# Altium schematic sheet 001-0001_Christmas_Ornament.SchDoc: Christmas Ornament
size A3; ApprovedBy: [FILL-HERE]; Author: HILT; Organization: Hilt; Address1: [FILL-HERE]; Address2: [FILL-HERE]; Address3: [FILL-HERE]; Address4: [FILL-HERE]; DocumentNumber: 001-0001; Revision: 0; SheetNumber: 1; SheetTotal: 2; ProjectTitle: Christmas Ornament
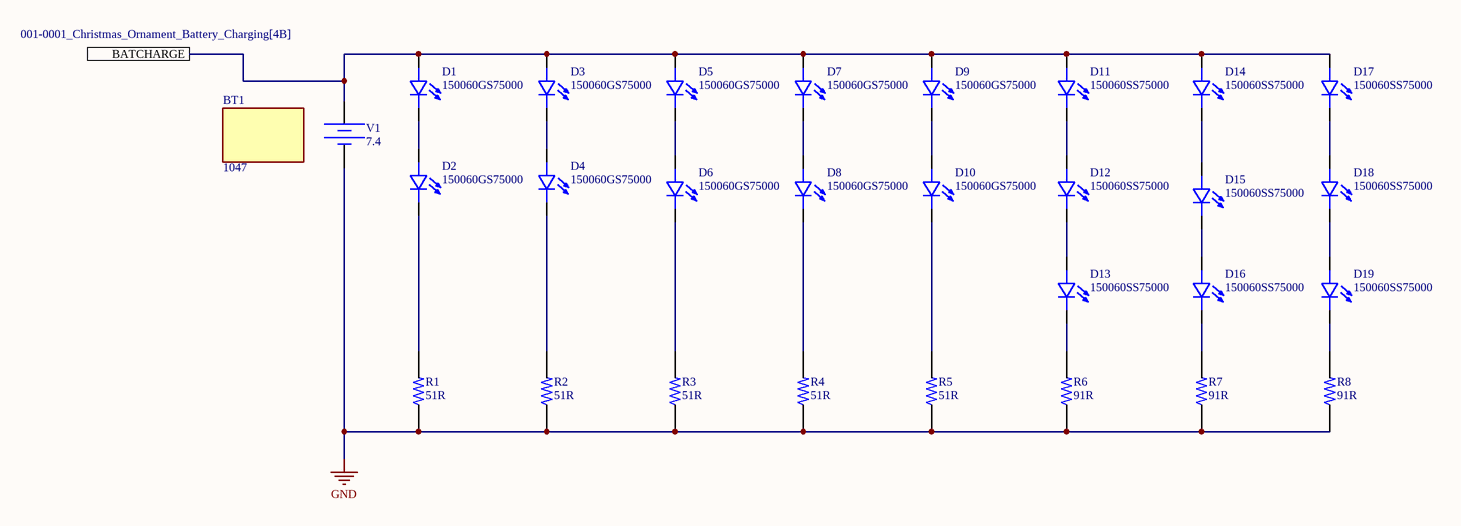
[diagram p0: 001-0001_Christmas_Ornament.SchDoc]

## Parts
BT1  1047  [BAT_1047]
D1  150060GS75000  [LEDC1608X80N]
D2  150060GS75000  [LEDC1608X80N]
D3  150060GS75000  [LEDC1608X80N]
D4  150060GS75000  [LEDC1608X80N]
D5  150060GS75000  [LEDC1608X80N]
D6  150060GS75000  [LEDC1608X80N]
D7  150060GS75000  [LEDC1608X80N]
D8  150060GS75000  [LEDC1608X80N]
D9  150060GS75000  [LEDC1608X80N]
D10  150060GS75000  [LEDC1608X80N]
D11  150060SS75000  [LED_150060SS75000]
D12  150060SS75000  [LED_150060SS75000]
D13  150060SS75000  [LED_150060SS75000]
D14  150060SS75000  [LED_150060SS75000]
D15  150060SS75000  [LED_150060SS75000]
D16  150060SS75000  [LED_150060SS75000]
D17  150060SS75000  [LED_150060SS75000]
D18  150060SS75000  [LED_150060SS75000]
D19  150060SS75000  [LED_150060SS75000]
R1  51R  [ERJ-PA3F51R0V]
R2  51R  [ERJ-PA3F51R0V]
R3  51R  [ERJ-PA3F51R0V]
R4  51R  [ERJ-PA3F51R0V]
R5  51R  [ERJ-PA3F51R0V]
R6  91R  [ERJ-PA3F91R0V]
R7  91R  [ERJ-PA3F91R0V]
R8  91R  [ERJ-PA3F91R0V]
V1  DC Magnitude: 7.4  (hidden comment: Constant Voltage Source)

## Ports
BATCHARGE (see 001-0001_Christmas_Ornament_Battery_Charging[4B])

## Nets
GND: R1.1 R2.1 R3.1 R4.1 R5.1 R6.1 R7.1 R8.1 V1.2
BATCHARGE: D1.A D3.A D5.A D7.A D9.A D11.A D14.A D17.A V1.1 ; port BATCHARGE
NetD1_C: D1.C D2.A
NetD2_C: D2.C R1.2
NetD3_C: D3.C D4.A
NetD4_C: D4.C R2.2
NetD5_C: D5.C D6.A
NetD6_C: D6.C R3.2
NetD7_C: D7.C D8.A
NetD8_C: D8.C R4.2
NetD9_C: D9.C D10.A
NetD10_C: D10.C R5.2
NetD11_C: D11.C D12.A
NetD12_C: D12.C D13.A
NetD13_C: D13.C R6.2
NetD14_C: D14.C D15.A
NetD15_C: D15.C D16.A
NetD16_C: D16.C R7.2
NetD17_C: D17.C D18.A
NetD18_C: D18.C D19.A
NetD19_C: D19.C R8.2

## Notes on the sheet
- Title:
- Author:
- Approved:
- Size:
- Date:
- Git Hash:
- A3
- Prj:
- SW Version:
- Variant:
- Edited:
- File:

## Library data of the parts
BT1 = 1047: 18650 Dual Battery Holder; Package: None; Price: None; Value: *; MP: 1047; Availability: Unavailable; Supplier 1: Digikey; Supplier Part Number 1: 36-1047-ND
D1-D10 = 150060GS75000: Green 520nm LED Indication - Discrete 3.2V 0603 (1608 Metric); MF: Wurth Electronics; SnapEDA_Link: https://www.snapeda.com/parts/150060GS75000/Wurth%20Electronics%20Inc./view-part/548131/?ref=snap; Availability: Warning; Price: None; Value: *; DigiKey-Purchase-URL: https://snapeda.com/shop?store=DigiKey&id=548131; Mouser-Purchase-URL: https://snapeda.com/shop?store=Mouser&id=548131; MP: 150060GS75000; Package: 0603 WÃ¼rth Elektronik; Supplier 1: Digikey; Supplier Part Number 1: 732-4971-1-ND
D11-D19 = 150060SS75000: Red 630nm LED Indication - Discrete 1.9V 0603 (1608 Metric)  <a href="https://pricing.snapeda.com/parts/150060SS75000/W%C3%BCrth%20Elektronik/view-part?ref=eda">Check availability</a>; MF: {'manufacturer': u'Wurth Electronics'}; Package: None; Price: None; Value: *; MP: 150060SS75000; Availability: Unavailable; Supplier 1: Digikey; Supplier Part Number 1: 732-4979-1-ND
R1-R5 = ERJ-PA3F51R0V: RES SMD 51 OHM 1% 1/3W 0603; MP: ERJPA3F51R0V; Price: None; Value: *; Availability: Unavailable; Package: None; Supplier 1: Digikey; Supplier Part Number 1: P51.00BYCT-ND
R6-R8 = ERJ-PA3F91R0V: RES SMD 91 OHM 1% 1/3W 0603; MP: ERJPA3F91R0V; Price: None; Availability: Unavailable; Value: *; Package: None; Supplier 1: Digikey; Supplier Part Number 1: P91.00BYCT-ND
V1 = Battery: SimulationGenericComponent: True